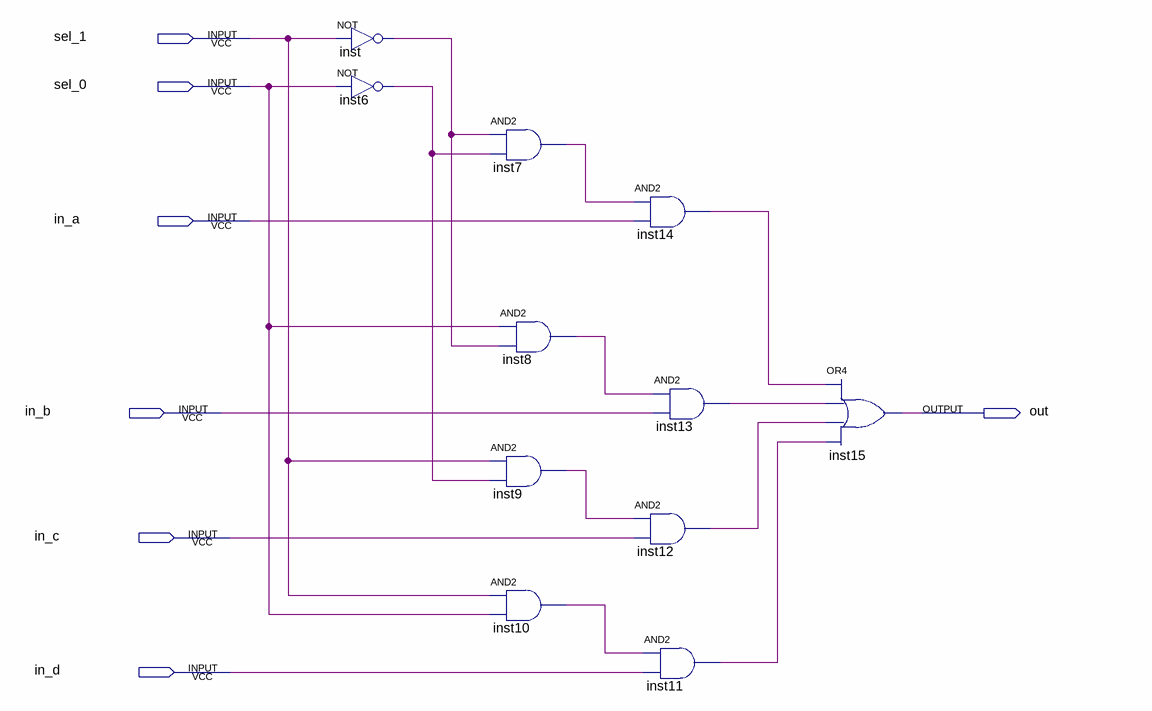
[diagram p0: schematic sheet]
// Quartus schematic Dex.bdf as structural Verilog: 11 symbols, 7 pins
module Dex (
  input  sel_1,
  input  sel_0,
  input  in_a,
  input  in_b,
  input  in_c,
  input  in_d,
  output out
);

  wire inst6_out, inst7_out, inst8_out, inst9_out, inst10_out, inst11_out, inst12_out, inst13_out,
       inst14_out, inst_out;

  not inst (inst_out, sel_1);
  not inst6 (inst6_out, sel_0);
  and inst7 (inst7_out, inst_out, inst6_out);
  and inst9 (inst9_out, sel_1, inst6_out);
  and inst10 (inst10_out, sel_1, sel_0);
  and inst8 (inst8_out, sel_0, inst_out);
  and inst14 (inst14_out, inst7_out, in_a);
  and inst12 (inst12_out, inst9_out, in_c);
  and inst11 (inst11_out, inst10_out, in_d);
  and inst13 (inst13_out, inst8_out, in_b);
  or inst15 (out, inst14_out, inst13_out, inst12_out, inst11_out);
endmodule
